# EAGLE schematic v0.3.0 (EAGLE 9.2.0)
Assembly variants: meanwell, aimtec

## Sheet 1 of 2
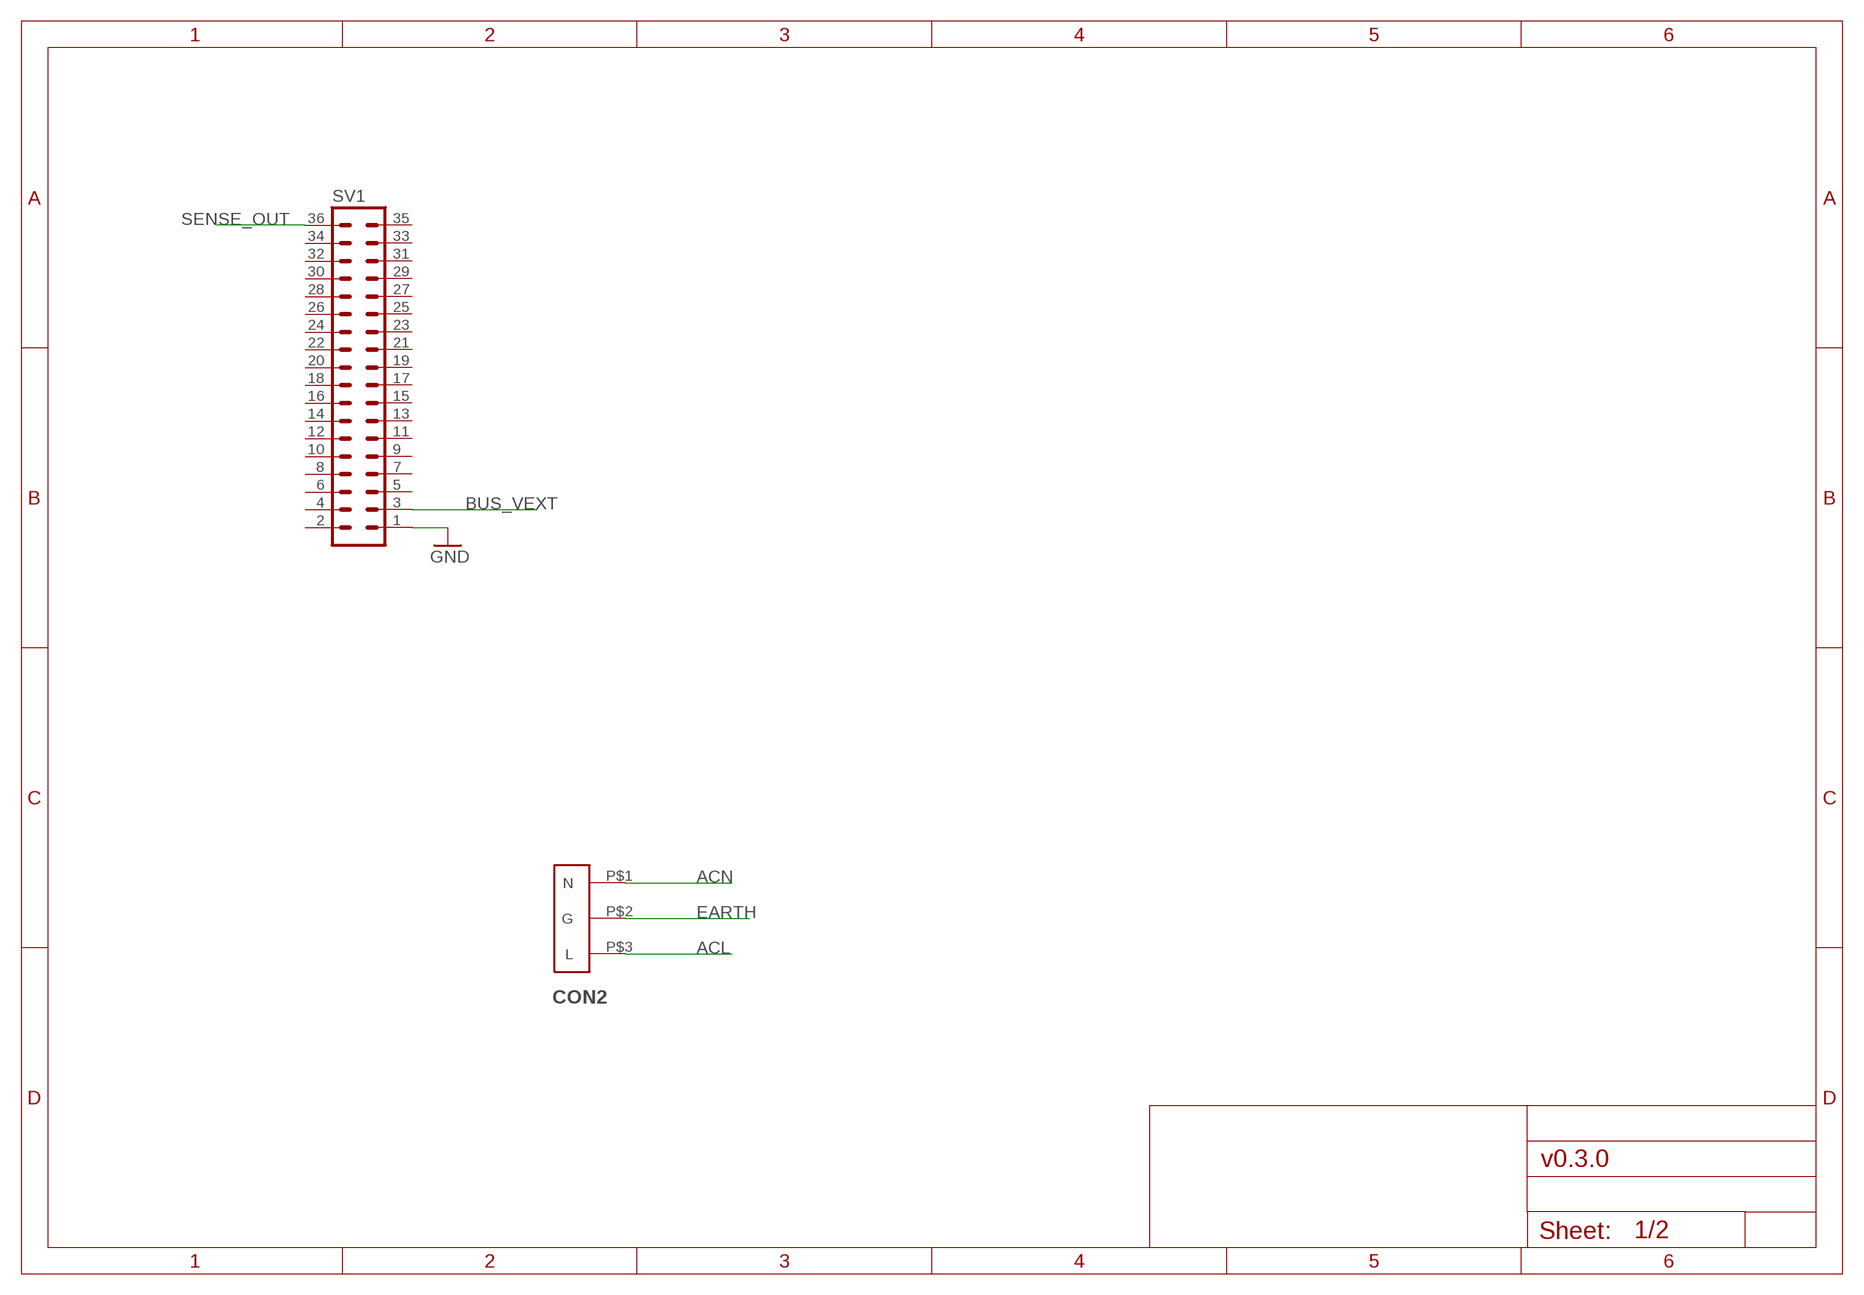
[diagram p0: schematic, sheet 1]

### Parts
CON2  4300.0101  [IEC-C6]
SV1  MA18-2  [MA18-2]  (not fitted in variant meanwell)  (not fitted in variant aimtec)

### Nets
ACL: CON2.P$3(L) ; also sheet 2
ACN: CON2.P$1(N) ; also sheet 2
BUS_VEXT: SV1.3 ; also sheet 2
EARTH: CON2.P$2(G) ; also sheet 2
GND: SV1.1 ; also sheet 2
SENSE_OUT: SV1.36 ; also sheet 2
Unconnected: SV1.2 SV1.4 SV1.5 SV1.6 SV1.7 SV1.8 SV1.9 SV1.10 SV1.11 SV1.12 SV1.13 SV1.14 SV1.15 SV1.16 SV1.17 SV1.18 SV1.19 SV1.20 SV1.21 SV1.22 SV1.23 SV1.24 SV1.25 SV1.26 SV1.27 SV1.28 SV1.29 SV1.30 SV1.31 SV1.32 SV1.33 SV1.34 SV1.35

## Sheet 2 of 2
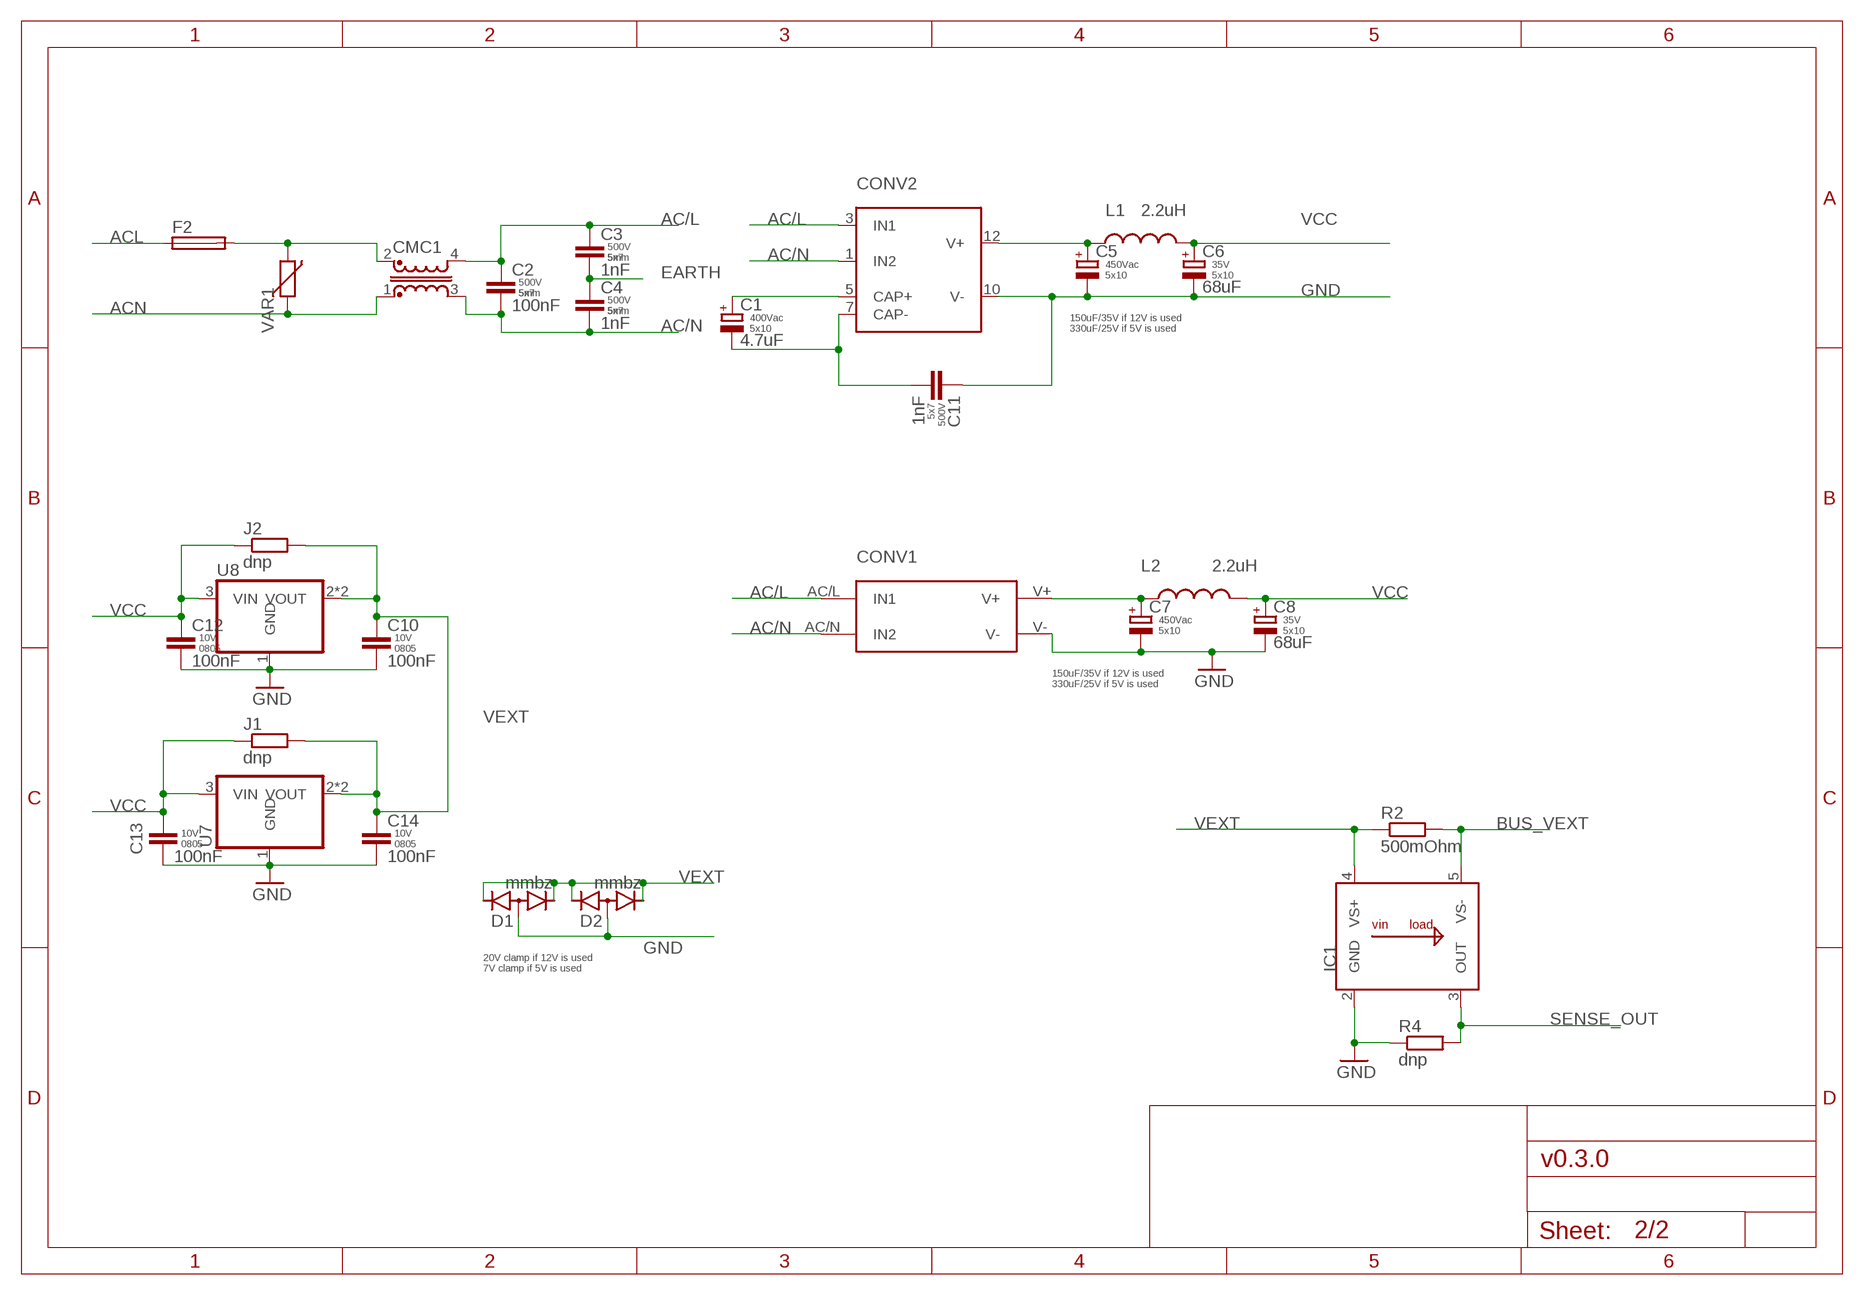
[diagram p1: schematic, sheet 2]

### Parts
C1  4.7uF  CAP-POL-5PX10WX16H  [CAPPRD508W65D1000H1600B]  (not fitted in variant meanwell)
C2  100nF  CAP-P5W6H8T2.5  [C050-025X075]
C3  1nF  CAP-P5W6H8T2.5  [C050-025X075]
C4  1nF  CAP-P5W6H8T2.5  [C050-025X075]
C5  CAP-POL-5PX10WX16H  [CAPPRD508W65D1000H1600B]  (not fitted in variant meanwell)
C6  68uF  CAP-POL-5PX10WX16H  [CAPPRD508W65D1000H1600B]  (not fitted in variant meanwell)
C7  CAP-POL-5PX10WX16H  [CAPPRD508W65D1000H1600B]  (not fitted in variant aimtec)
C8  68uF  CAP-POL-5PX10WX16H  [CAPPRD508W65D1000H1600B]  (not fitted in variant aimtec)
C10  100nF  CAP-0805  [C0805]  (not fitted in variant meanwell)
C11  1nF  CAP-P5W6H8T2.5  [C050-025X075]  (not fitted in variant meanwell)
C12  100nF  CAP-0805  [C0805]  (not fitted in variant meanwell)
C13  100nF  CAP-0805  [C0805]  (not fitted in variant aimtec)
C14  100nF  CAP-0805  [C0805]  (not fitted in variant aimtec)
CMC1  DLD-302U-1A  [DLD]
CONV1  IRM-03-12V  [IRM-03]  (not fitted in variant aimtec)
CONV2  AMEOF312SJZ  [AMEOF3-JZ]  (not fitted in variant meanwell)
D1  mmbz  DIODE-2CA|ACSOT23  [SOT23]  (not fitted in variant aimtec)
D2  mmbz  DIODE-2CA|ACSOT23  [SOT23]  (not fitted in variant meanwell)
F2  ZH8  [ZH8X2]
IC1  ZXCT1021  [SOT95P240X110-5]
J1  dnp  R-EU_R0805  [R0805]  (not fitted in variant aimtec)
J2  dnp  R-EU_R0805  [R0805]  (not fitted in variant meanwell)
L1  2.2uH  COIL0608-0.022  [COIL0608]  (not fitted in variant meanwell)
L2  2.2uH  COIL0608-0.022  [COIL0608]  (not fitted in variant aimtec)
R2  500mOhm  R-EU_R0805  [R0805]
R4  dnp  R-EU_R0603  [R0603]
U7  LD1117S50  [SOT230P700X180-4]  (not fitted in variant aimtec)
U8  LD1117S50  [SOT230P700X180-4]  (not fitted in variant meanwell)
VAR1  S14K250  [C7.5B4]

### Nets
AC/L: C2.1 C3.1 CMC1.4 CONV1.AC/L(IN1) CONV2.3(IN1)
AC/N: C2.2 C4.2 CMC1.3 CONV1.AC/N(IN2) CONV2.1(IN2)
ACL: F2.1 F2.1A ; also sheet 1
ACN: CMC1.1 VAR1.1 ; also sheet 1
BUS_VEXT: IC1.5(VS-) R2.2 ; also sheet 1
EARTH: C3.2 C4.1 ; also sheet 1
GND: C5.2(-) C6.2(-) C7.2(-) C8.2(-) C10.2 C11.1 C12.2 C13.2 C14.2 CONV1.V- CONV2.10(V-) D1.3(A) D2.3(A) IC1.2(GND) R4.1 U7.1(GND) U8.1(GND) ; also sheet 1
N$1: C1.1(+) CONV2.5(CAP+)
N$2: C1.2(-) C11.2 CONV2.7(CAP-)
N$3: C5.1(+) CONV2.12(V+) L1.P$1
N$4: CMC1.2 F2.2 F2.2A VAR1.2
N$6: C7.1(+) CONV1.V+ L2.P$1
SENSE_OUT: IC1.3(OUT) R4.2 ; also sheet 1
VCC: C6.1(+) C8.1(+) C12.1 C13.1 J1.1 J2.1 L1.P$2 L2.P$2 U7.3(VIN) U8.3(VIN)
VEXT: C10.1 C14.1 D1.1(K1) D1.2(K2) D2.1(K1) D2.2(K2) IC1.4(VS+) J1.2 J2.2 R2.1 U7.2(VOUT) U7.4(VOUT) U8.2(VOUT) U8.4(VOUT)

### Notes on the sheet
- 150uF/35V if 12V is used
  330uF/25V if 5V is used
- 150uF/35V if 12V is used
  330uF/25V if 5V is used
- 20V clamp if 12V is used
  7V clamp if 5V is used

## Library data of the parts
C1 = parts-passives:CAP-POL-; PACKAGE: 5x10; RATING: 400Vac
C2-C4 = parts-passives:CAP-; DIMENSIONS: 5mm; PACKAGE: 5x7; RATING: 500V
C5 C7 = parts-passives:CAP-POL-; PACKAGE: 5x10; RATING: 450Vac
C6 C8 = parts-passives:CAP-POL-; PACKAGE: 5x10; RATING: 35V
C10 C12-C14 = parts-passives:CAP-; PACKAGE: 0805; RATING: 10V
C11 = parts-passives:CAP-; PACKAGE: 5x7; RATING: 500V
CMC1 = parts-ferrocore:DLD-
CON2 = parts-schurter:4300.0101
CONV1 = parts-meanwell:IRM-
CONV2 = parts-aimtec:AMEOF3
D1 D2 = diode:DIODE-2CA|AC: Dual DIODE Cathode-Anode|Anode-Cathode
F2 = parts-profuse:ZH8: there are two zh8 holders used
IC1 = parts-diodes:ZXCT1021
J1 J2 R2 R4 = rcl:R-EU_: RESISTOR, European symbol; SPICEPREFIX: R
L1 L2 = parts-ferrocore:COIL0608-
SV1 = con-lstb:MA18-2: PIN HEADER; OC_FARNELL: unknown; OC_NEWARK: unknown
U7 U8 = parts-st:LD1117
VAR1 = parts-epcos:S14K250